# EAGLE design Solar PCB - Modular (EAGLE 9.6.2)
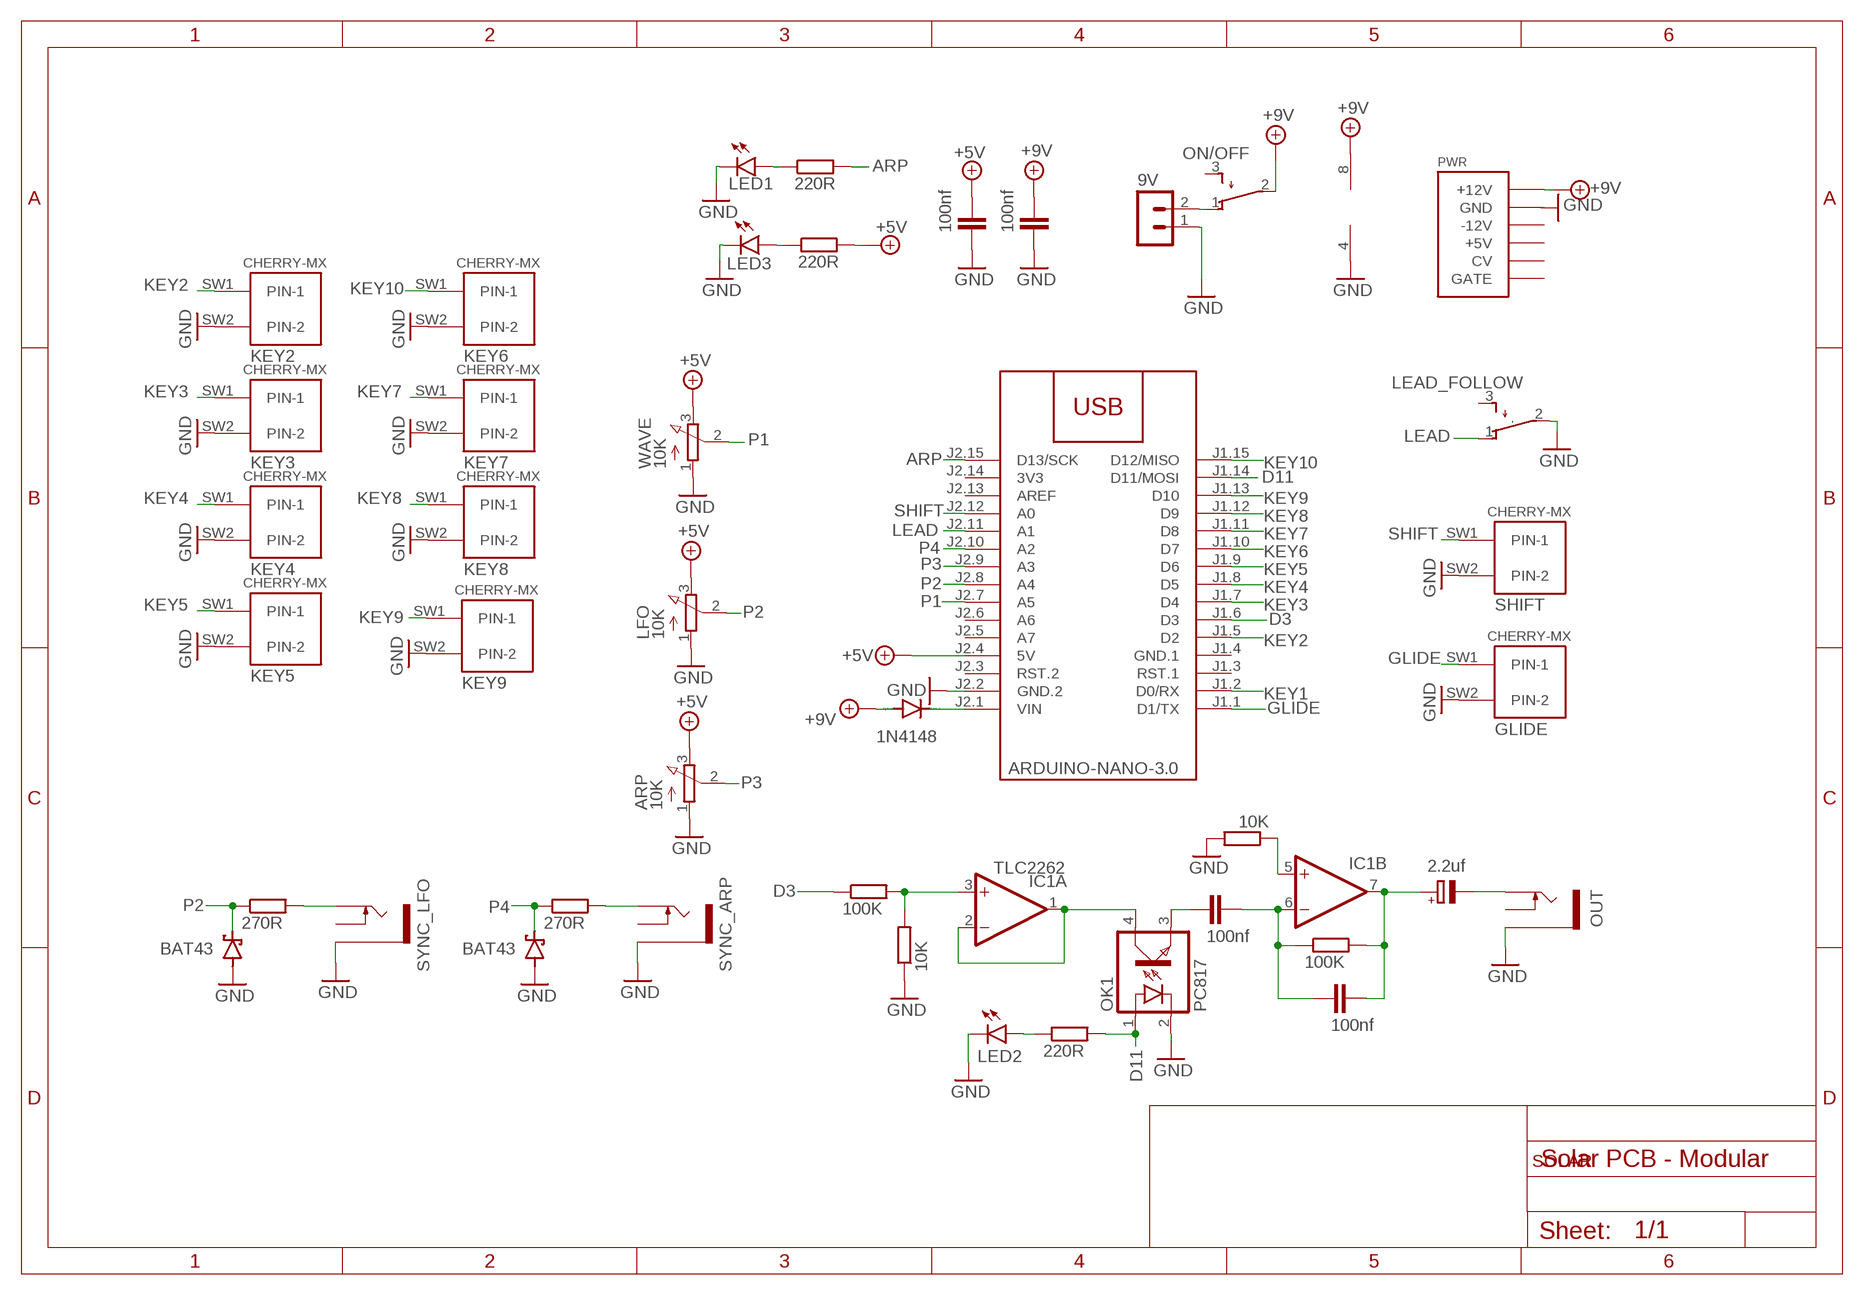
[diagram p0: schematic, sheet 1]

## Parts
9V  B2B-PH-K-S  [B2B-PH-K-S]
ARP  10K  EVUF2L  [EVUFXL]
C1  100nf  C-EU050-024X044  [C050-024X044]
C2  100nf  C-EU050-024X044  [C050-024X044]
C3  100nf  C-EU050-024X044  [C050-024X044]
C4  2.2uf  CPOL-EUE2,5-6E  [E2,5-6E]
C5  100nf  C-EU050-024X044  [C050-024X044]
D1  BAT43  BAT42  [DO35-10]
D2  1N4148  1N4148DO35-7  [DO35-7]
D3  BAT43  BAT42  [DO35-10]
GLIDE  CHERRY-MX  [CHERRY-MX]
IC1  TLC2262  TL072P  [DIL08]
KEY2  CHERRY-MX  [CHERRY-MX]
KEY3  CHERRY-MX  [CHERRY-MX]
KEY4  CHERRY-MX  [CHERRY-MX]
KEY5  CHERRY-MX  [CHERRY-MX]
KEY6  CHERRY-MX  [CHERRY-MX]
KEY7  CHERRY-MX  [CHERRY-MX]
KEY8  CHERRY-MX  [CHERRY-MX]
KEY9  CHERRY-MX  [CHERRY-MX]
LEAD_FOLLOW  TL32PO  [TL3XPO]
LED1  LED3MM  [LED3MM]
LED2  LED3MM  [LED3MM]
LED3  LED5MM  [LED5MM]
LFO  10K  EVUF2L  [EVUFXL]
M1  ARDUINO-NANO-3.0  [ARDUINO-NANO-3.0]
OK1  PC817  [DIL04]
ON/OFF  TL32PO  [TL3XPO]
OUT  THONKICONNNEW  [WQP-PJ301M-12_JACK]
PWR  POWER  [POWER_16]
R1  100K  R-EU_0207/10  [0207/10]
R2  10K  R-EU_0207/10  [0207/10]
R3  100K  R-EU_0207/10  [0207/10]
R4  10K  R-EU_0207/10  [0207/10]
R5  220R  R-EU_0207/10  [0207/10]
R6  270R  R-EU_0207/10  [0207/10]
R7  270R  R-EU_0207/10  [0207/10]
R8  220R  R-EU_0207/10  [0207/10]
R10  220R  R-EU_0207/10  [0207/10]
SHIFT  CHERRY-MX  [CHERRY-MX]
SYNC_ARP  THONKICONNNEW  [WQP-PJ301M-12_JACK]
SYNC_LFO  THONKICONNNEW  [WQP-PJ301M-12_JACK]
WAVE  10K  EVUF2L  [EVUFXL]

## Nets
+5V: ARP.3(E) C5.2 LFO.3(E) M1.J2.4(5V) R5.2 WAVE.3(E)
+9V: C2.2 D2.A IC1.8(P:V+) ON/OFF.2(P) PWR.9(+12V) PWR.10(+12V)
ARP: M1.J2.15(D13/SCK) R8.2
D3: M1.J1.6(D3) R1.1
D11: M1.J1.14(D11/MOSI) OK1.1(A) R10.2
GLIDE: GLIDE.SW1(PIN-1) M1.J1.1(D1/TX)
GND: 9V.1 ARP.1(A) C2.1 C5.1 D1.A D3.A GLIDE.SW2(PIN-2) IC1.4(P:V-) KEY2.SW2(PIN-2) KEY3.SW2(PIN-2) KEY4.SW2(PIN-2) KEY5.SW2(PIN-2) KEY6.SW2(PIN-2) KEY7.SW2(PIN-2) KEY8.SW2(PIN-2) KEY9.SW2(PIN-2) LEAD_FOLLOW.2(P) LED1.K(C) LED2.K(C) LED3.K(C) LFO.1(A) M1.J2.2(GND.2) OK1.2(C) OUT.P$3_SLEEVE(SLEEVE) PWR.3(GND) PWR.4(GND) PWR.5(GND) PWR.6(GND) PWR.7(GND) PWR.8(GND) R2.1 R4.2 SHIFT.SW2(PIN-2) SYNC_ARP.P$3_SLEEVE(SLEEVE) SYNC_LFO.P$3_SLEEVE(SLEEVE) WAVE.1(A)
KEY1: M1.J1.2(D0/RX)
KEY2: KEY2.SW1(PIN-1) M1.J1.5(D2)
KEY3: KEY3.SW1(PIN-1) M1.J1.7(D4)
KEY4: KEY4.SW1(PIN-1) M1.J1.8(D5)
KEY5: KEY5.SW1(PIN-1) M1.J1.9(D6)
KEY6: M1.J1.10(D7)
KEY7: KEY7.SW1(PIN-1) M1.J1.11(D8)
KEY8: KEY8.SW1(PIN-1) M1.J1.12(D9)
KEY9: KEY9.SW1(PIN-1) M1.J1.13(D10)
KEY10: KEY6.SW1(PIN-1) M1.J1.15(D12/MISO)
LEAD: LEAD_FOLLOW.1(O) M1.J2.11(A1)
N$1: LED1.A R8.1
N$2: 9V.2 ON/OFF.1(O)
N$3: IC1.3(A:+IN) R1.2 R2.2
N$4: R7.2 SYNC_LFO.P$1_TIP(TIP)
N$5: IC1.1(A:OUT) IC1.2(A:-IN) OK1.4(COL)
N$6: C1.1 OK1.3(EMIT)
N$7: C1.2 C3.1 IC1.6(B:-IN) R3.1
N$8: IC1.5(B:+IN) R4.1
N$9: C3.2 C4.+ IC1.7(B:OUT) R3.2
N$10: C4.- OUT.P$1_TIP(TIP)
N$11: LED3.A R5.1
N$12: R6.2 SYNC_ARP.P$1_TIP(TIP)
N$16: LED2.A R10.1
N$19: D2.C M1.J2.1(VIN)
P1: M1.J2.7(A5) WAVE.2(S)
P2: D1.C LFO.2(S) M1.J2.8(A4) R7.1
P3: ARP.2(S) M1.J2.9(A3)
P4: D3.C M1.J2.10(A2) R6.1
SHIFT: M1.J2.12(A0) SHIFT.SW1(PIN-1)
Unconnected: LEAD_FOLLOW.3(S) M1.J1.3(RST.1) M1.J2.3(RST.2) M1.J2.5(A7) M1.J2.6(A6) M1.J2.13(AREF) ON/OFF.3(S) OUT.P$2_SWITCH(SWITCH) PWR.1(-12V) PWR.2(-12V) PWR.11(+5V) PWR.12(+5V) PWR.13(CV) PWR.14(CV) PWR.15(GATE) PWR.16(GATE) SYNC_ARP.P$2_SWITCH(SWITCH) SYNC_LFO.P$2_SWITCH(SWITCH)

## Notes on the sheet
- SOLAR

## Power pins joined to a net without a drawn wire
3V3: M1.J2.14(3V3)
GND.1: M1.J1.4(GND.1)

## Library data of the parts
9V = con-JST PH:B2B-PH: JST PH series header 2.00mm pitch disconnectable crimp style connectors, vertical (side entry type), 2 pins
ARP LFO WAVE = pot:EVU: 9 mm Square Rotary Potentiometers Source: Panasonic
C1-C3 C5 = rcl:C-EU: CAPACITOR, European symbol; SPICEPREFIX: C
C4 = rcl:CPOL-EU: POLARIZED CAPACITOR, European symbol; SPICEPREFIX: C
D1 D3 = diode:BAT42: DIODE barrier diode
D2 = diode:1N4148: DIODE high speed (Philips)
GLIDE KEY2-KEY9 SHIFT = cherrymx:CHERRY-MX: Cherry MX series keyswitch
IC1 = linear:TL072: OP AMP
LEAD_FOLLOW ON/OFF = switch:TL32PO: TINY SWITCH ON - MOM Source: http://www2.produktinfo.conrad.com/datenblaetter/700000-724999/705152-da-01-de-Subminiaturschalter_TL_36YO.pdf
LED1-LED3 = led:LED: LED OSRAM: - CHIPLED LG R971, LG N971, LY N971, LG Q971, LY Q971, LO R971, LY R971 LH N974, LH R974 LS Q976, LO Q976, LY Q976 LO Q996 - Hyper CHIPLED LW Q18S LB Q993, LB Q99A, LB R99A - SideLED LS A670, LO A670, LY A670, LG A670, LP A670 LB A673, LV A673, LT A673, LW A673 LH A674 LY A675 LS A676, LA A676, LO A676, LY A676, LW A676 LS A679, LY A679, LG A679 - Hyper Micro SIDELED® LS Y876, LA Y876, LO Y876, LY Y876 LT Y87S - SmartLED LW L88C, LW L88S LB L89C, LB L89S, LG L890 LS L89K, LO L89K, LY L89K LS L896, LA L896, LO L896, LY L896 - TOPLED LS T670, LO T670, LY T670, LG T670, LP T670 LSG T670, LSP T670, LSY T670, LOP T670, LYG T670 LG T671, LOG T671, LSG T671 LB T673, LV T673, LT T673, LW T673 LH T674 LS T676, LA T676, LO T676, LY T676, LB T676, LH T676, LSB T676, LW T676 LB T67C, LV T67C, LT T67C, LS T67K, LO T67K, LY T67K, LW E67C LS E67B, LA E67B, LO E67B, LY E67B, LB E67C, LV E67C, LT E67C LW T67C LS T679, LY T679, LG T679 LS T770, LO T770, LY T770, LG T770, LP T770 LB T773, LV T773, LT T773, LW T773 LH T774 LS E675, LA E675, LY E675, LS T675 LS T776, LA T776, LO T776, LY T776, LB T776 LHGB T686 LT T68C, LB T68C - Hyper Mini TOPLED® LB M676 - Mini TOPLED Santana® LG M470 LS M47K, LO M47K, LY M47K Source: http://www.osram.convergy.de LUXEON: - LUMILED® LXK2-PW12-R00, LXK2-PW12-S00, LXK2-PW14-U00, LXK2-PW14-V00 LXK2-PM12-R00, LXK2-PM12-S00, LXK2-PM14-U00 LXK2-PE12-Q00, LXK2-PE12-R00, LXK2-PE12-S00, LXK2-PE14-T00, LXK2-PE14-U00 LXK2-PB12-K00, LXK2-PB12-L00, LXK2-PB12-M00, LXK2-PB14-N00, LXK2-PB14-P00, LXK2-PB14-Q00 LXK2-PR12-L00, LXK2-PR12-M00, LXK2-PR14-Q00, LXK2-PR14-R00 LXK2-PD12-Q00, LXK2-PD12-R00, LXK2-PD12-S00 LXK2-PH12-R00, LXK2-PH12-S00 LXK2-PL12-P00, LXK2-PL12-Q00, LXK2-PL12-R00 Source: www.luxeon.com KINGBRIGHT: KA-3528ASYC Source: www.kingbright.com
M1 = diy-modules:ARDUINO-NANO-3.0: Arduino Nano 3.0 and compatible devices More details available here: https://www.arduino.cc/en/Main/ArduinoBoardNano Click here to find device on ebay.com <http://www.ebay.com/sch/arduino+nano>
OK1 = optocoupler:PC817: SHARP OPTO COUPLER; MPN: PC817X4J000F; OC_FARNELL: 9707727; OC_NEWARK: 97K7059
OUT SYNC_ARP SYNC_LFO = MusicThingModular:THONKICONN: 3.5mm socket for Eurorack modular synths
PWR = EurorackModularParts:POWER
R1-R8 R10 = rcl:R-EU_: RESISTOR, European symbol; SPICEPREFIX: R

## Board
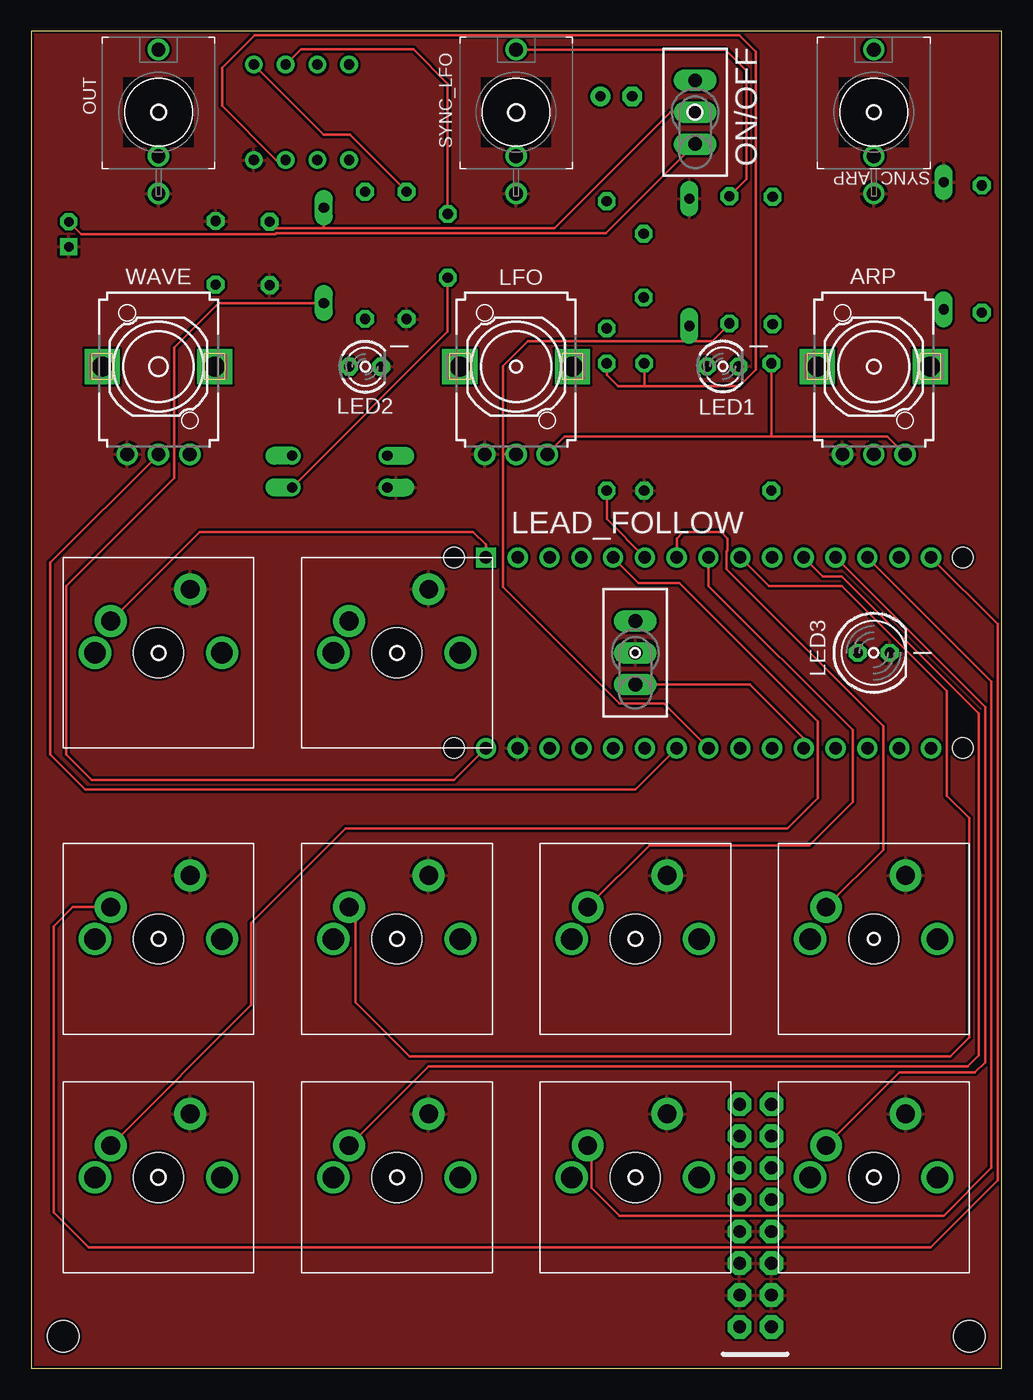
[diagram p1: board, top side]
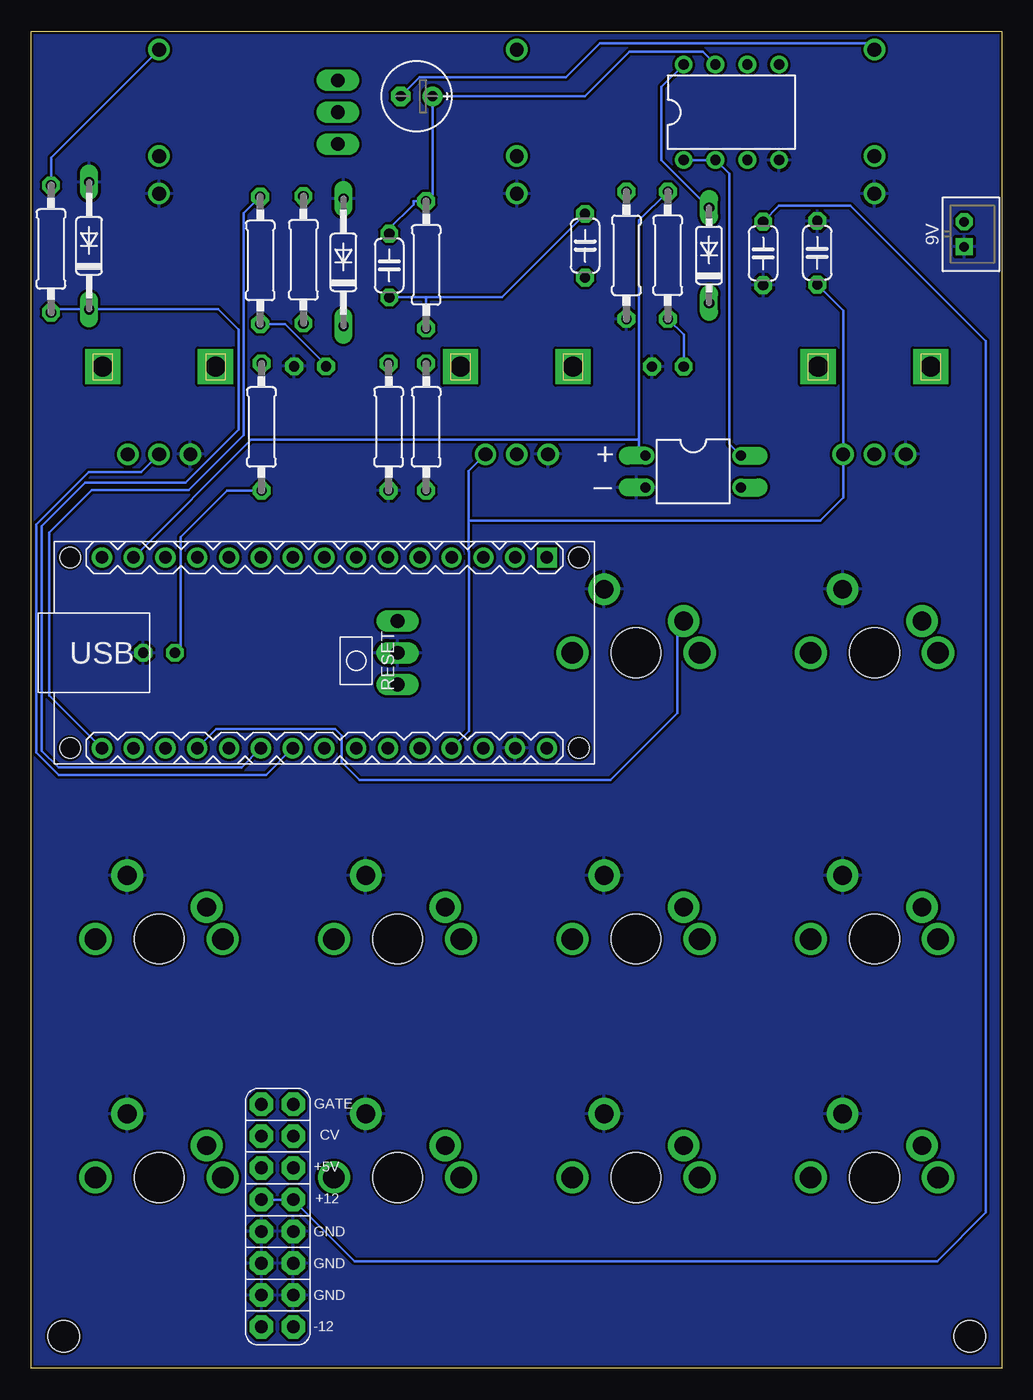
[diagram p2: board, bottom side, seen from below]

Size 77.52 x 106.8 mm. Coordinates in mm from the lower left corner, seen from the top.
Outline: 0,0 77.52,0 77.52,106.8 0,106.8 0,0
Copper layers (1*16): Top 0.035mm / dielectric 1.5mm / Bottom 0.035mm
Design rules "SparkFun": minimum track width 8mil, minimum drill 20mil, track to track 8mil, track to pad 8mil, pad to pad 8mil, via to via 8mil, smd to smd 8mil, copper to edge 8mil, drill to drill 8mil, minimum pad ring 12mil, minimum via ring 10mil, stop-mask expansion 4mil, vias tented up to drill 20mil, thermal gap 10mil
Holes 2.54 mm at 2.54,2.54 74.93,2.54

### Footprints (pad centres in the part's own frame; a part is rotated, then mirrored left to right if it is on the bottom)
B2B-PH-K-S = drill 0.75 pad 1.3 square: 1 1,0 | drill 0.75 pad 1.3 octagon: 2 -1,0
EVUFXL = drill 1.1 pad 1.676: 1 -2.5,-7; 2 0,-7; 3 2.5,-7 | drill 1.6 pad 2.8 square: M1 4.5,0; M2 -4.5,0
C050-024X044 = drill 0.813 octagon: 1 -2.54,0; 2 2.54,0
E2,5-6E = drill 0.813 pad 1.575: + -1.27,0 | drill 0.813 pad 1.575 octagon: - 1.27,0
DO35-10 = drill 0.813 long: A 5.08,0; C -5.08,0
DO35-7 = drill 0.813 long: A 3.81,0; C -3.81,0
CHERRY-MX = drill 1.714 pad 1.93: P$3 -5.08,0; P$4 5.08,0 | drill 1.5 pad 2.54: SW1 -3.81,2.54; SW2 2.54,5.08 | hole 4: 0,0
DIL08 = drill 0.813 pad 1.27: 1 -3.81,-3.81; 2 -1.27,-3.81; 3 1.27,-3.81; 4 3.81,-3.81; 5 3.81,3.81; 6 1.27,3.81; 7 -1.27,3.81; 8 -3.81,3.81
TL3XPO = drill 1.1 pad 1.422 long: 1 -2.54,0; 2 0,0; 3 2.54,0
LED3MM = drill 0.813 octagon: A -1.27,0; K 1.27,0
LED5MM = drill 0.813 octagon: A -1.27,0; K 1.27,0
ARDUINO-NANO-3.0 = drill 1 square: J1.1 17.78,7.62 | drill 1: J1.2 15.24,7.62; J1.3 12.7,7.62; J1.4 10.16,7.62; J1.5 7.62,7.62; J1.6 5.08,7.62; J1.7 2.54,7.62; J1.8 0,7.62; J1.9 -2.54,7.62; J1.10 -5.08,7.62; J1.11 -7.62,7.62; J1.12 -10.16,7.62; J1.13 -12.7,7.62; J1.14 -15.24,7.62; J1.15 -17.78,7.62; J2.1 17.78,-7.62; J2.2 15.24,-7.62; J2.3 12.7,-7.62; J2.4 10.16,-7.62; J2.5 7.62,-7.62; J2.6 5.08,-7.62; J2.7 2.54,-7.62; J2.8 0,-7.62; J2.9 -2.54,-7.62; J2.10 -5.08,-7.62; J2.11 -7.62,-7.62; J2.12 -10.16,-7.62; J2.13 -12.7,-7.62; J2.14 -15.24,-7.62; J2.15 -17.78,-7.62 | hole 1.651: -20.32,7.62; -20.32,-7.62; 20.32,-7.62; 20.32,7.62
DIL04 = drill 0.813 offset: 1 -1.27,-3.81; 2 1.27,-3.81; 3 1.27,3.81; 4 -1.27,3.81
WQP-PJ301M-12_JACK = drill 1.1: P$1_TIP 0,5; P$2_SWITCH 0,-3.5; P$3_SLEEVE 0,-6.5
POWER_16 = drill 1.016 pad 1.88 octagon: 1 -8.89,-1.27; 2 -8.89,1.27; 3 -6.35,-1.27; 4 -6.35,1.27; 5 -3.81,-1.27; 6 -3.81,1.27; 7 -1.27,-1.27; 8 -1.27,1.27; 9 1.27,-1.27; 10 1.27,1.27; 11 3.81,-1.27; 12 3.81,1.27; 13 6.35,-1.27; 14 6.35,1.27; 15 8.89,-1.27; 16 8.89,1.27
0207/10 = drill 0.813 octagon: 1 -5.08,0; 2 5.08,0

### Placement (x,y rotation side)
9V  3,90.58 270 bottom
ARP  67.31,80.01 0 top
C1  33.27,89.66 90 bottom
C2  19.05,89.05 90 bottom
C3  48.92,88.09 90 bottom
C4  46.74,101.6 180 bottom
C5  14.73,89.1 270 bottom
D1  52.58,88.34 90 bottom
D2  23.37,88.9 90 bottom
D3  72.9,89.66 90 bottom
GLIDE  10.16,57.15 0 top
IC1  21.59,100.33 0 bottom
KEY2  10.16,15.24 0 top
KEY3  67.31,34.29 0 top
KEY4  48.26,34.29 0 top
KEY5  29.21,34.29 0 top
KEY6  10.16,34.29 0 top
KEY7  29.21,15.24 0 top
KEY8  67.31,15.24 0 top
KEY9  48.26,15.24 0 top
LEAD_FOLLOW  48.26,57.15 90 top
LED1  55.24,80.04 0 top
LED2  26.67,80.01 0 top
LED3  67.31,57.15 0 top
LFO  38.73,80.01 0 top
M1  54.1,57.15 0 bottom
OK1  24.64,71.63 270 bottom
ON/OFF  53.04,100.33 90 top
OUT  10.16,100.33 0 top
PWR  57.86,12.19 90 bottom
R1  45.97,75.18 90 bottom
R2  48.97,75.18 90 bottom
R3  45.97,88.14 90 bottom
R4  29.97,88.9 270 bottom
R5  59.13,75.18 90 bottom
R6  75.95,89.41 90 bottom
R7  55.78,88.54 90 bottom
R8  59.23,88.49 90 bottom
R10  26.67,88.9 90 bottom
SHIFT  29.21,57.15 0 top
SYNC_ARP  67.31,100.33 0 top
SYNC_LFO  38.73,100.33 0 top
WAVE  10.16,80.01 0 top

### Tracks (layer width: path | path; a pad name or v marks a point on that pad's centre or on a via)
+5V
  Top 0.203: ARP.3 68.4,74.42 59.13,74.42 | 59.13,74.42 42.61,74.42 41.23,73.05 LFO.3 | R5.2 59.13,74.42
  Bottom 0.203: M1.J2.4 42.56,50.91 42.56,65.23 42.57,65.22 42.57,67.72 | LFO.3 42.57,71.67 42.57,67.72 | 42.57,67.72 14.48,67.72 12.66,69.53 WAVE.3 12.66,84.49 C5.2
+9V
  Top 0.203: ON/OFF.2 51.05,100.33 41.81,91.08 23.37,91.08 | C2.2 19.56,91.08 23.37,91.08 | D2.A 23.37,91.08
  Bottom 0.203: D2.A 27.18,96.52 27.18,102.36 IC1.8 | PWR.10 PWR.9 51.69,8.56 5.16,8.56 1.27,12.45 1.27,82.04 12.09,92.86 17.78,92.86 C2.2
ARP
  Bottom 0.203: M1.J2.15 76.07,53.72 76.07,66.75 72.69,70.13 64.95,70.13 60.55,74.52 60.55,92.25 R8.2
D3
  Top 0.203: M1.J1.6 45.97,67.82 R1.1
D11
  Bottom 0.203: M1.J1.14 59.94,74.17 28.96,74.17 | R10.2 28.96,91.69 28.96,74.17 | 28.96,74.17 28.96,73.41 OK1.1
GLIDE
  Top 0.203: GLIDE.SW1 13.46,66.8 35.31,66.8 36.32,65.79 M1.J1.1
GND
  pour Top: 0,106.78 77.55,106.78 77.55,0 0,0
  pour Bottom: 0,106.78 77.55,106.78 77.55,0 0,0
KEY2
  Top 0.203: M1.J1.5 48.51,62.74 51.77,62.74 62.84,51.67 62.84,45.57 60.4,43.13 25.12,43.13 17.58,35.59 17.58,29.01 KEY2.SW1
KEY3
  Top 0.203: KEY3.SW1 68.07,41.4 68.07,51.31 55.53,63.85 55.53,65.23 55.63,65.32 55.63,66.29 55.12,66.8 52.07,66.8 51.56,66.29 M1.J1.7
KEY4
  Top 0.203: M1.J1.8 54.1,62.49 65.63,50.97 65.63,45.24 62.14,41.76 49.38,41.76 KEY4.SW1
KEY5
  Top 0.203: KEY5.SW1 25.91,36.32 25.91,29.21 30.23,24.89 73.41,24.89 74.93,26.42 74.93,38.86 74.93,39.12 74.93,43.94 73.15,45.72 73.15,54.1 64.77,62.48 58.93,62.48 M1.J1.9
KEY7
  Top 0.203: M1.J1.11 63.25,63.25 64.75,63.25 75.69,52.3 75.69,24.99 74.83,24.13 31.75,24.13 KEY7.SW1
KEY8
  Top 0.203: M1.J1.12 76.2,52.83 76.2,24.43 75.39,23.62 70.87,23.62 69.34,23.62 KEY8.SW1
KEY9
  Top 0.203: M1.J1.13 66.78,64.77 76.71,54.84 76.71,21 76.71,16 72.9,12.19 46.99,12.19 44.77,14.41 44.77,17.46 KEY9.SW1
KEY10
  Top 0.203: M1.J1.15 77.22,59.44 77.22,15 71.86,9.65 4.57,9.65 1.78,12.45 1.78,35.31 3.3,36.83 KEY6.SW1
LEAD
  Top 0.203: M1.J2.11 61.72,50.29 57.4,54.61 LEAD_FOLLOW.1
N$1
  Bottom 0.203: LED1.A 53.98,80.14 57.25,83.41 R8.1
N$2
  Top 0.203: 9V.2 4,90.58 19.47,90.58 19.57,90.68 45.92,90.68 ON/OFF.1
N$3
  Top 0.203: IC1.3 19.56,96.52 15.24,100.84 15.24,103.89 17.84,106.49 56.58,106.49 57.89,105.18 57.89,79.76 56.57,78.44 48.92,78.44 | R1.2 45.97,79.35 46.89,78.44 48.92,78.44 | R2.2 48.97,78.49 48.92,78.44
N$4
  Top 0.203: SYNC_LFO.P$1_TIP 55.47,105.33 57.15,103.65 57.15,95 R7.2
N$5
  Bottom 0.203: OK1.4 21.75,73.82 21.75,95.25 21.75,95.41 IC1.2 IC1.1
N$6
  Top 0.203: OK1.3 33.27,82.8 C1.1
N$7
  Top 0.203: C1.2 33.27,102.62 30.53,105.36 21.54,105.36 IC1.6
  Bottom 0.203: C1.2 39.93,85.55 45.97,85.55 | 45.97,85.55 C3.1 | R3.1 45.97,85.55
N$8
  Top 0.203: IC1.5 23.37,98.55 25.45,98.55 29.97,94.03 R4.1
N$9
  Bottom 0.203: IC1.7 23.88,105.16 29.72,105.16 33.27,101.6 C4.+ 45.47,93.73 R3.2 46.99,93.22 46.99,92.96 48.92,91.03 C3.2
N$10
  Bottom 0.203: C4.- 46.48,103.12 34.8,103.12 32.08,105.84 10.67,105.84 OUT.P$1_TIP
N$11
  Bottom 0.203: LED3.A 65.58,57.61 65.58,66.4 61.87,70.1 R5.1
N$12
  Bottom 0.203: SYNC_ARP.P$1_TIP 75.95,96.69 R6.2
N$16
  Bottom 0.203: LED2.A 25.4,82.55 R10.1
N$19
  Top 0.203: M1.J2.1 33.78,46.99 4.83,46.99 2.79,49.02 2.79,62.48 11.43,71.12 11.43,81.53 14.99,85.09 D2.C
P1
  Top 0.203: M1.J2.7 48.26,46.23 4.32,46.23 1.52,49.02 1.52,64.36 10.12,72.96 10.12,72.97 WAVE.2
P2
  Top 0.203: M1.J2.8 50.55,53.09 46.99,53.09 37.67,62.41 37.67,73.01 | 37.67,73.01 LFO.2 | 37.67,73.01 37.67,80.04 39.67,82.04 52.58,82.04 | D1.C 52.58,82.04 | 52.58,82.04 54.41,82.04 55.78,83.41 R7.1
P3
  Bottom 0.203: M1.J2.9 58.78,47.4 75.34,47.4 77.11,49.17 77.11,67.41 72.95,71.58 68.74,71.58 ARP.2
P4
  Bottom 0.203: M1.J2.10 60.73,47.98 75.35,47.98 76.67,49.31 76.67,67.28 73.21,70.74 65.2,70.74 60.96,74.98 60.96,82.96 62.59,84.58 D3.C 75.69,84.58 R6.1
SHIFT
  Bottom 0.203: SHIFT.SW1 25.91,59.18 25.91,52.32 31.24,46.99 51.31,46.99 52.73,48.41 52.73,50.55 53.24,51.05 62.74,51.05 M1.J2.12

### Text on the board
tPlace: _ | _ | _
bPlace: + | _